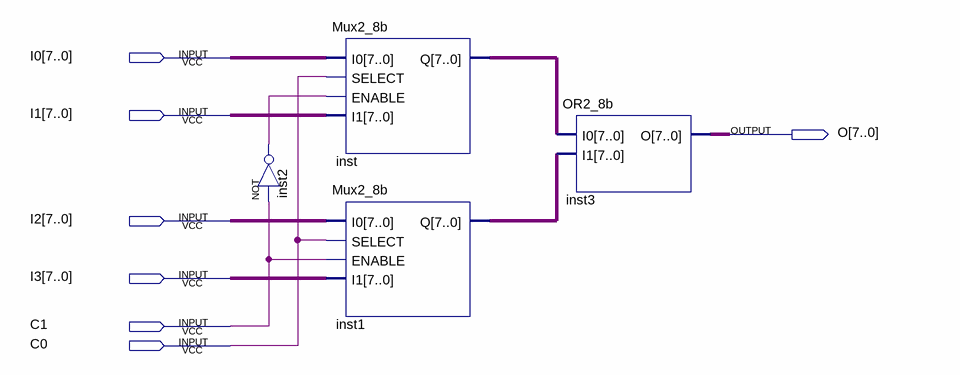
[diagram p0: schematic sheet]
// Quartus schematic Mux4_8b.bdf as structural Verilog: 4 symbols, 7 pins
module Mux4_8b (
  input  [7:0] I0,
  input  [7:0] I1,
  input  [7:0] I2,
  input  [7:0] I3,
  input  C1,
  input  C0,
  output [7:0] O
);

  wire inst2_out;
  wire [7:0] inst1_q, inst_q;

  not inst2 (inst2_out, C1);
  Mux2_8b inst (.I0(I0), .SELECT(C0), .ENABLE(inst2_out), .I1(I1), .Q(inst_q));
  Mux2_8b inst1 (.I0(I2), .SELECT(C0), .ENABLE(C1), .I1(I3), .Q(inst1_q));
  OR2_8b inst3 (.I0(inst_q), .I1(inst1_q), .O(O));
endmodule
